# Altium schematic sheet LSM6DSRXTR.SchDoc
size A4; SheetNumber: 5; SheetTotal: 11
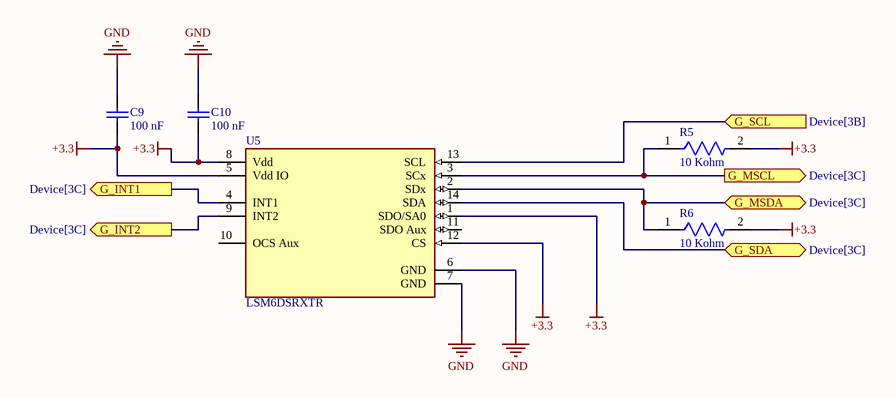
[diagram p0: LSM6DSRXTR.SchDoc]

## Parts
C9  100 nF  [CAPC1005X55X25NL05T10]
C10  100 nF  [CAPC1005X55X25NL05T10]
R5  10 Kohm  [FP-RC1005-IPC_C]
R6  10 Kohm  [FP-RC1005-IPC_C]
U5  LSM6DSRXTR  [FP-LGA-14L-DM00249496-MFG]

## Ports
G_INT1 (out, see Device[3C]), G_INT2 (out, see Device[3C]), G_MSCL (out, see Device[3C]), G_MSDA (bidir, see Device[3C]), G_SCL (in, see Device[3B]), G_SDA (bidir, see Device[3C])

## Nets
+3.3: C9.2 C10.2 R5.2 R6.2 U5.1(SDO/SA0) U5.5(Vdd_IO) U5.8(Vdd) U5.12(CS)
GND: C9.1 C10.1 U5.6(GND) U5.7(GND)
G_INT1: U5.4(INT1) ; port G_INT1
G_INT2: U5.9(INT2) ; port G_INT2
G_MSCL: R5.1 U5.3(SCx) ; port G_MSCL
G_MSDA: R6.1 U5.2(SDx) ; port G_MSDA
G_SCL: U5.13(SCL) ; port G_SCL
G_SDA: U5.14(SDA) ; port G_SDA

Not connected (* = marked no-connect by the designer): U5 10(OCS_Aux) 11(SDO_Aux)

## Library data of the parts
C9 C10 = CMP-2008-04515-1: Manufacturer: Murata; Part Number: GRM155F50J684ZE01D
R5 R6 = CMP-13261-000953-1: Res Thick Film 0402 1.87kΩ 1% 0.063W ±100ppm/°C Molded SMD T/R; Power Rating: 63mW; Voltage Rating (DC): 50V; Resistance: 1.87kR; Tolerance: 1%; Height: 0.016inch; Length: 1mm; Case Code (Metric): 1005; Width: 0.02inch; Max Power Dissipation: 63mW; Radiation Hardening: No; Features: Moisture Resistant; Temperature Coefficient: 100ppm/°C; Min Operating Temperature: -55°C; Number of Terminations: 2; Max Operating Temperature: 155°C; Case Code (Imperial): 0402; Composition: Thick Film; Depth: 0.5mm; Lead Free: Lead Free; Package Quantity: 1; Case/Package: 0402; Packaging: Tape and Reel; Contact Plating: Tin; Military Standard: Not
U5 = CMP-12177-000016-1: CONSUMER MEMS; RoHS Compliant: Yes